# Altium schematic sheet mux6-1(3wires)_sche.SchDoc
size A2 portrait
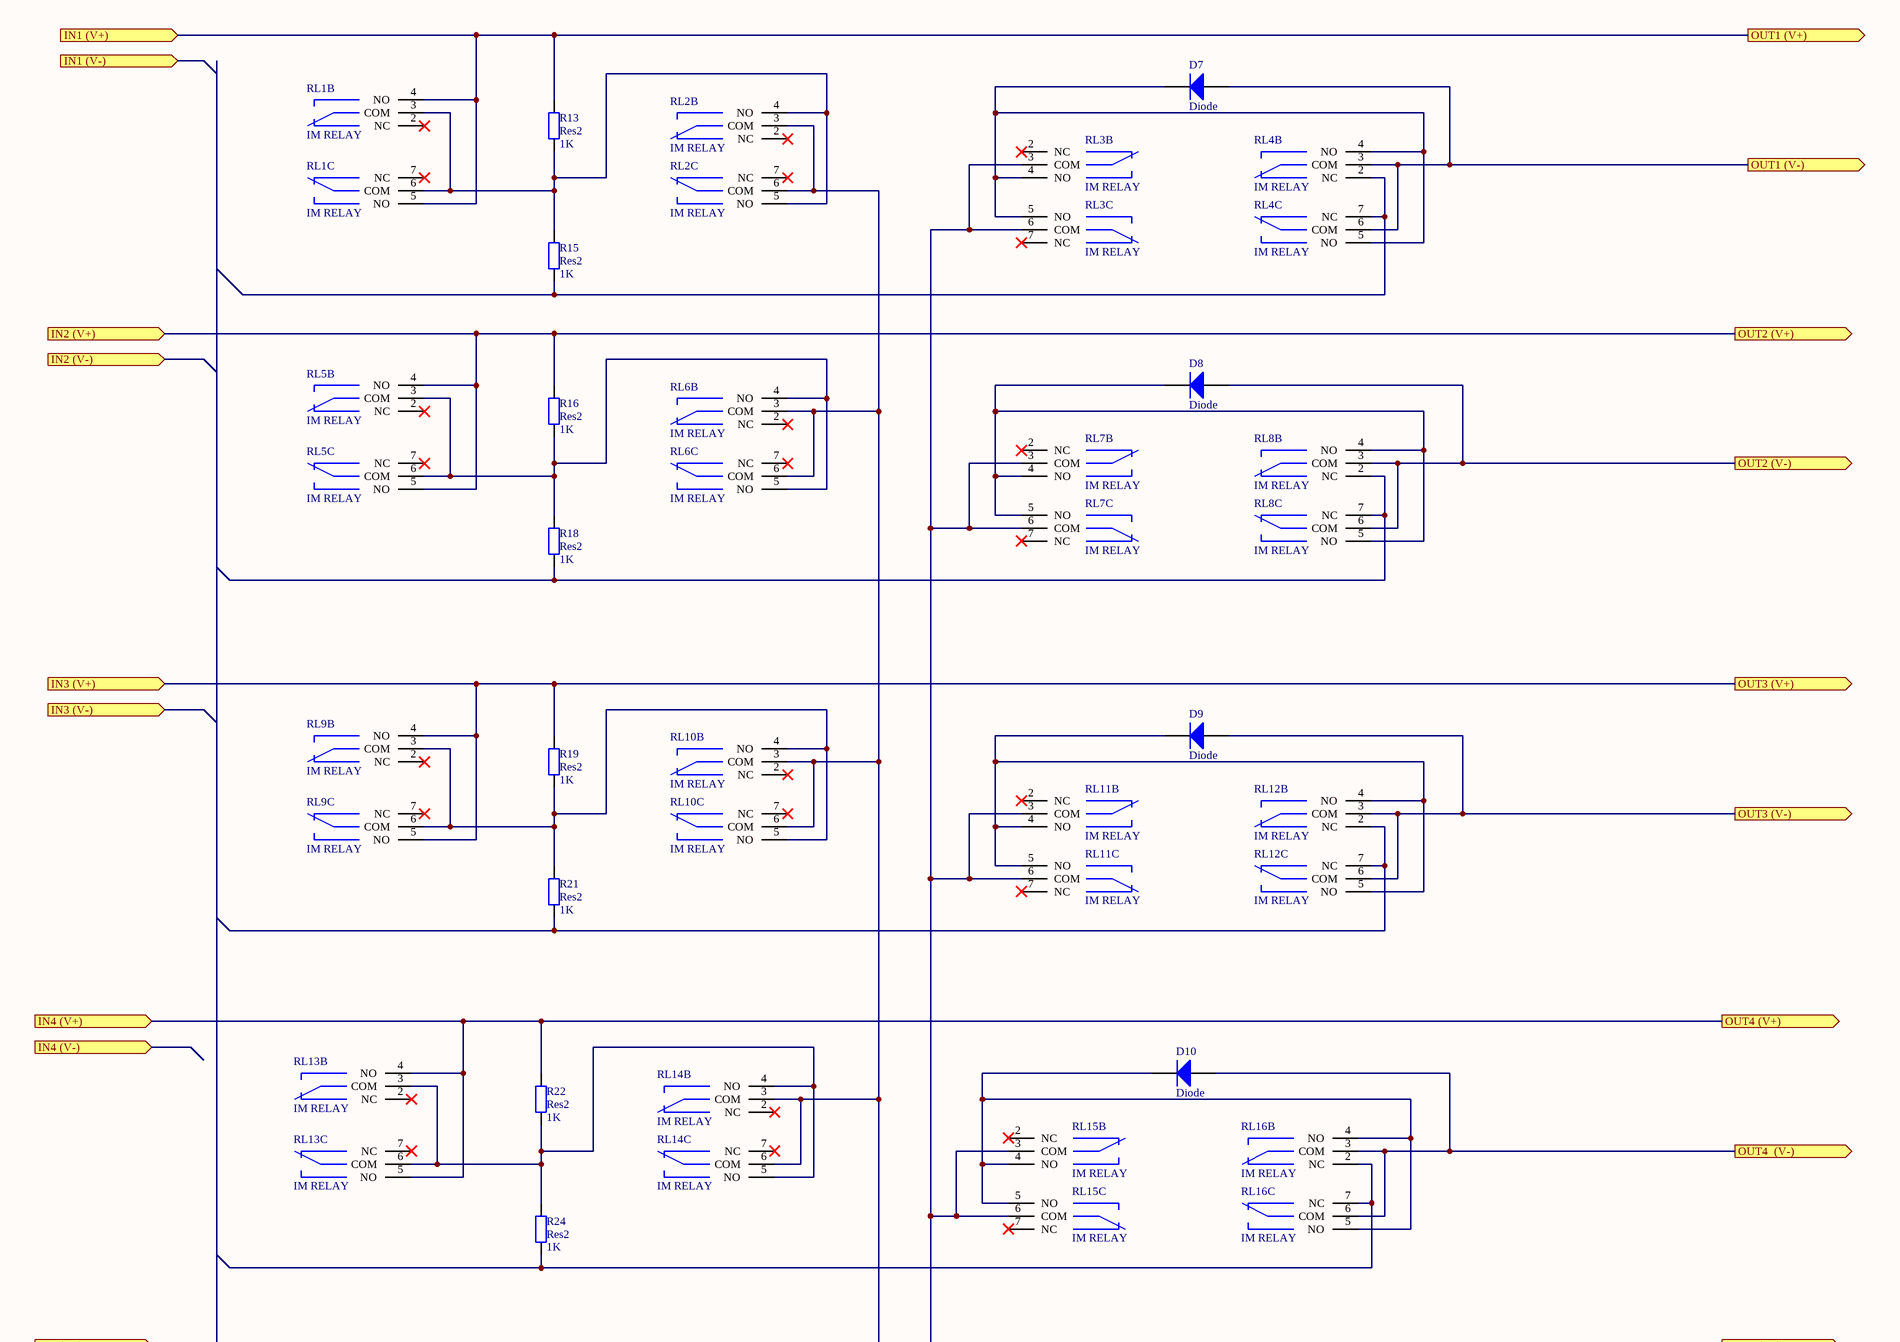
[diagram p0: mux6-1(3wires)_sche.SchDoc, top]
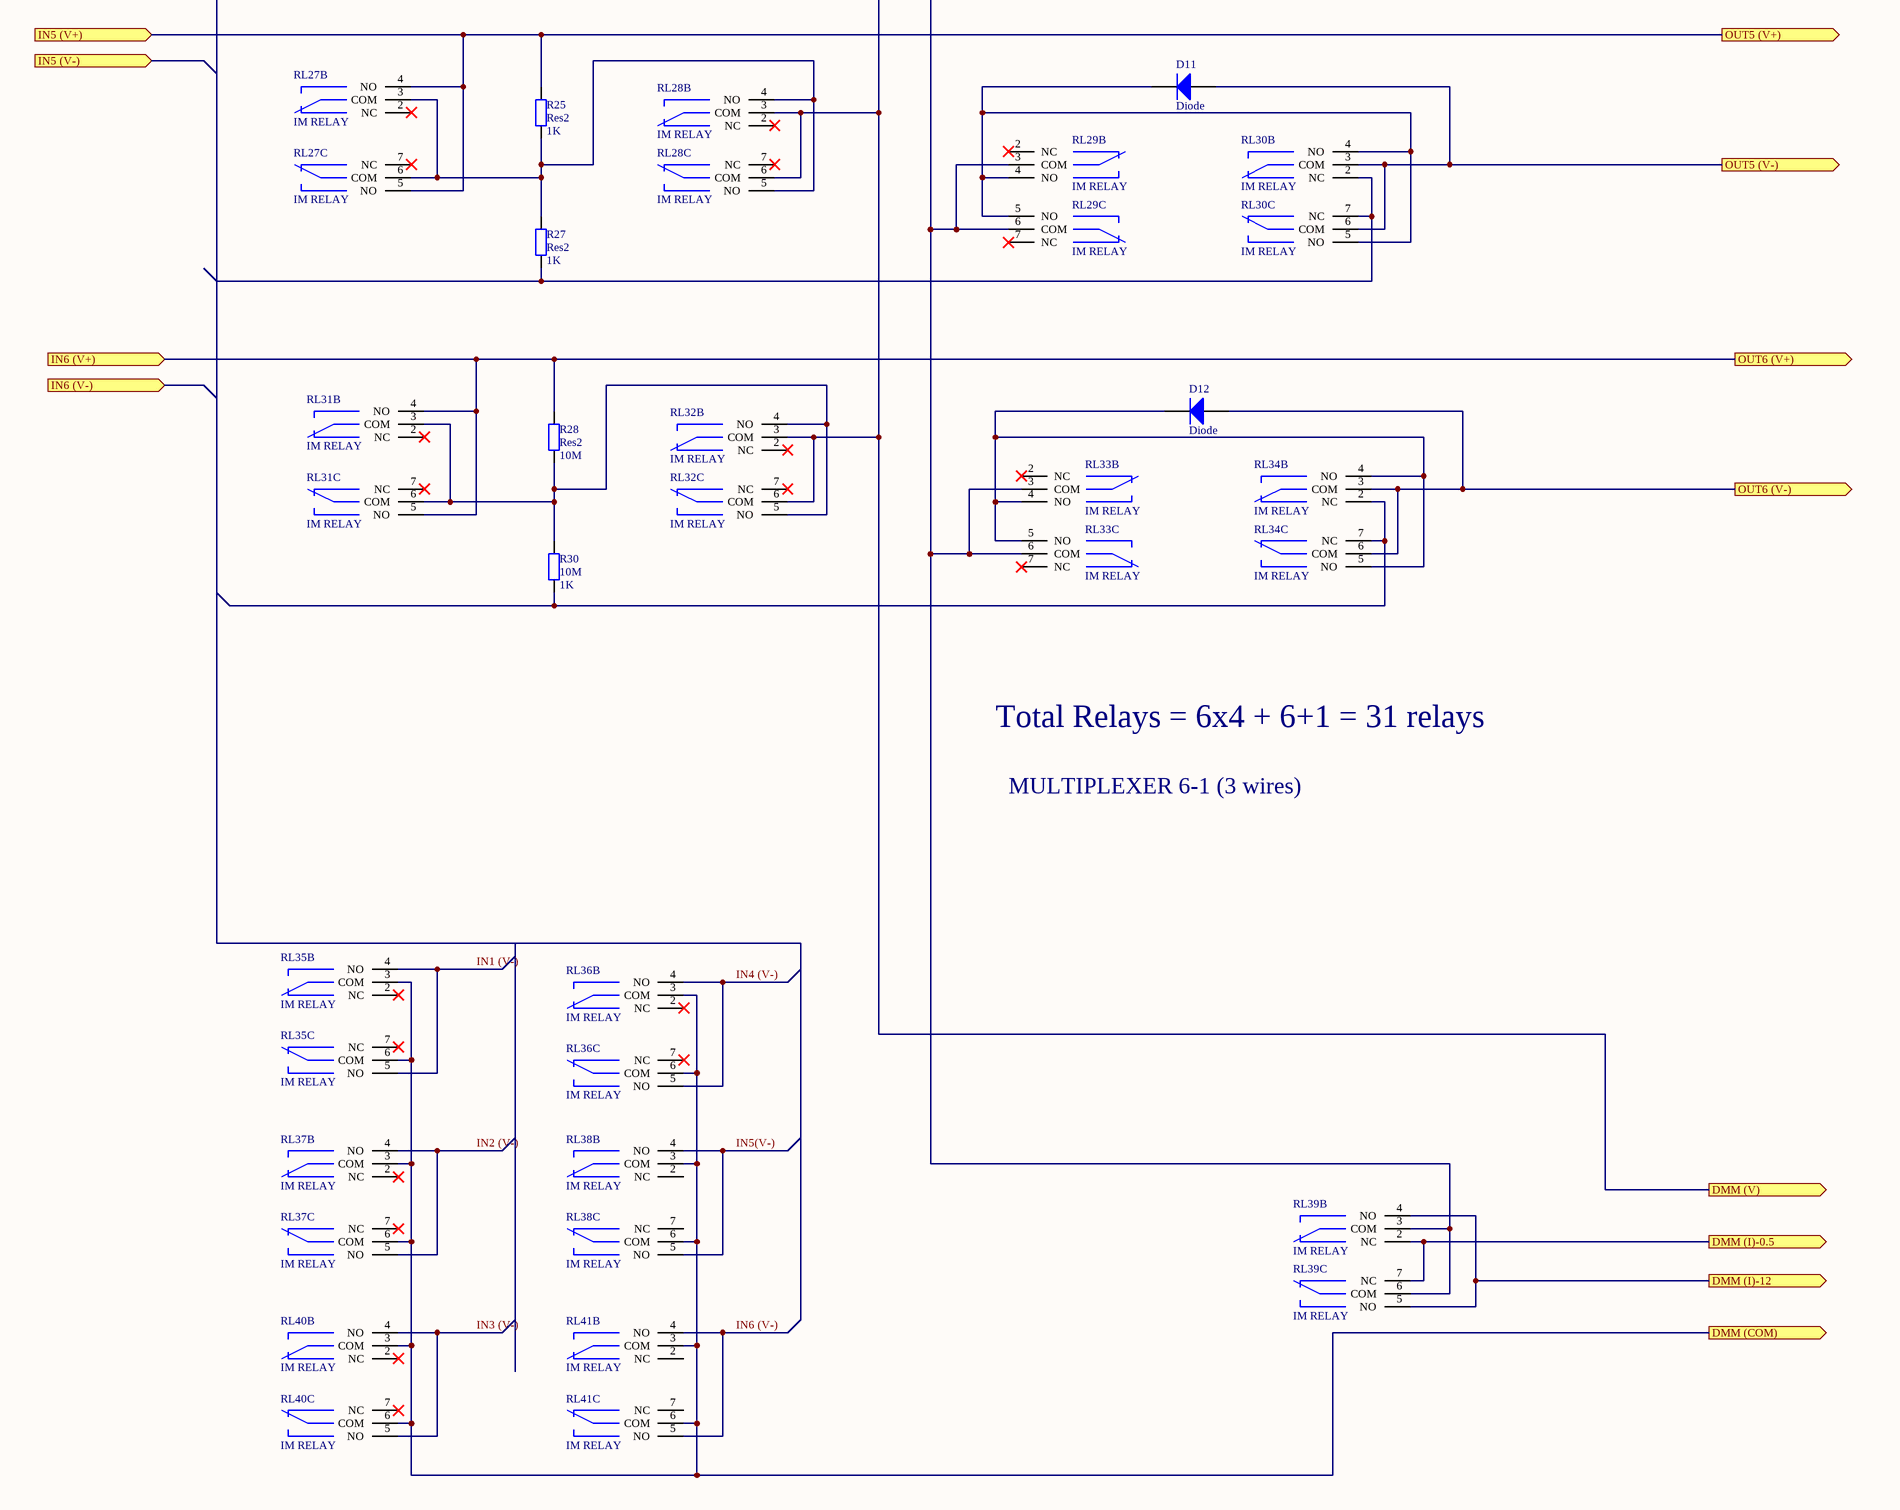
[diagram p1: mux6-1(3wires)_sche.SchDoc, bottom]

## Parts
D7  Diode  [DSO-C2/X3.3]
D8  Diode  [DSO-C2/X3.3]
D9  Diode  [DSO-C2/X3.3]
D10  Diode  [DSO-C2/X3.3]
D11  Diode  [DSO-C2/X3.3]
D12  Diode  [DSO-C2/X3.3]
R13  Res2  value 1K  [AXIAL-0.4]
R15  Res2  value 1K  [AXIAL-0.4]
R16  Res2  value 1K  [AXIAL-0.4]
R18  Res2  value 1K  [AXIAL-0.4]
R19  Res2  value 1K  [AXIAL-0.4]
R21  Res2  value 1K  [AXIAL-0.4]
R22  Res2  value 1K  [AXIAL-0.4]
R24  Res2  value 1K  [AXIAL-0.4]
R25  Res2  value 1K  [AXIAL-0.4]
R27  Res2  value 1K  [AXIAL-0.4]
R28  Res2  value 10M  [AXIAL-0.4]
R30  10M  value 1K  [AXIAL-0.4]
RL1  IM RELAY  [RELAY-DC]  (parts B,C of 3)
RL2  IM RELAY  [RELAY-DC]  (parts B,C of 3)
RL3  IM RELAY  [RELAY-DC]  (parts B,C of 3)
RL4  IM RELAY  [RELAY-DC]  (parts B,C of 3)
RL5  IM RELAY  [RELAY-DC]  (parts B,C of 3)
RL6  IM RELAY  [RELAY-DC]  (parts B,C of 3)
RL7  IM RELAY  [RELAY-DC]  (parts B,C of 3)
RL8  IM RELAY  [RELAY-DC]  (parts B,C of 3)
RL9  IM RELAY  [RELAY-DC]  (parts B,C of 3)
RL10  IM RELAY  [RELAY-DC]  (parts B,C of 3)
RL11  IM RELAY  [RELAY-DC]  (parts B,C of 3)
RL12  IM RELAY  [RELAY-DC]  (parts B,C of 3)
RL13  IM RELAY  [RELAY-DC]  (parts B,C of 3)
RL14  IM RELAY  [RELAY-DC]  (parts B,C of 3)
RL15  IM RELAY  [RELAY-DC]  (parts B,C of 3)
RL16  IM RELAY  [RELAY-DC]  (parts B,C of 3)
RL27  IM RELAY  [RELAY-DC]  (parts B,C of 3)
RL28  IM RELAY  [RELAY-DC]  (parts B,C of 3)
RL29  IM RELAY  [RELAY-DC]  (parts B,C of 3)
RL30  IM RELAY  [RELAY-DC]  (parts B,C of 3)
RL31  IM RELAY  [RELAY-DC]  (parts B,C of 3)
RL32  IM RELAY  [RELAY-DC]  (parts B,C of 3)
RL33  IM RELAY  [RELAY-DC]  (parts B,C of 3)
RL34  IM RELAY  [RELAY-DC]  (parts B,C of 3)
RL35  IM RELAY  [RELAY-DC]  (parts B,C of 3)
RL36  IM RELAY  [RELAY-DC]  (parts B,C of 3)
RL37  IM RELAY  [RELAY-DC]  (parts B,C of 3)
RL38  IM RELAY  [RELAY-DC]  (parts B,C of 3)
RL39  IM RELAY  [RELAY-DC]  (parts B,C of 3)
RL40  IM RELAY  [RELAY-DC]  (parts B,C of 3)
RL41  IM RELAY  [RELAY-DC]  (parts B,C of 3)

## Ports
DMM (COM) (out), DMM (I)-0.5 (out), DMM (I)-12 (out), DMM (V) (out), IN1 (V+) (in), IN1 (V-) (in), IN2 (V+) (in), IN2 (V-) (in), IN3 (V+) (in), IN3 (V-) (in), IN4 (V+) (in), IN4 (V-) (in), IN5 (V+) (in), IN5 (V-) (in), IN6 (V+) (in), IN6 (V-) (in), OUT1 (V+) (out), OUT1 (V-) (out), OUT2 (V+) (out), OUT2 (V-) (out), OUT3 (V+) (out), OUT3 (V-) (out), OUT4  (V-) (out), OUT4 (V+) (out), OUT5 (V+) (out), OUT5 (V-) (out), OUT6 (V+) (out), OUT6 (V-) (out)

## Nets
DMM (COM): RL35.3(COM) RL35.6(COM) RL36.3(COM) RL36.6(COM) RL37.3(COM) RL37.6(COM) RL38.3(COM) RL38.6(COM) RL40.3(COM) RL40.6(COM) RL41.3(COM) RL41.6(COM) ; port DMM (COM)
DMM (I)-0.5: RL39.2(NC) RL39.7(NC) ; port DMM (I)-0.5
DMM (I)-12: RL39.4(NO) RL39.5(NO) ; port DMM (I)-12
DMM (V): RL2.3(COM) RL2.6(COM) RL6.3(COM) RL6.6(COM) RL10.3(COM) RL10.6(COM) RL14.3(COM) RL14.6(COM) RL28.3(COM) RL28.6(COM) RL32.3(COM) RL32.6(COM) ; port DMM (V)
IN1 (V+): R13.2 RL1.4(NO) RL1.5(NO) ; port IN1 (V+), port OUT1 (V+)
IN1 (V-): RL35.4(NO) RL35.5(NO)
IN2 (V+): R16.2 RL5.4(NO) RL5.5(NO) ; port IN2 (V+), port OUT2 (V+)
IN2 (V-): RL37.4(NO) RL37.5(NO)
IN3 (V+): R19.2 RL9.4(NO) RL9.5(NO) ; port IN3 (V+), port OUT3 (V+)
IN3 (V-): RL40.4(NO) RL40.5(NO)
IN4 (V+): R22.2 RL13.4(NO) RL13.5(NO) ; port IN4 (V+), port OUT4 (V+)
IN4 (V-): RL36.4(NO) RL36.5(NO)
IN5 (V+): R25.2 RL27.4(NO) RL27.5(NO) ; port IN5 (V+), port OUT5 (V+)
IN5(V-): RL38.4(NO) RL38.5(NO)
IN6 (V+): R28.2 RL31.4(NO) RL31.5(NO) ; port IN6 (V+), port OUT6 (V+)
IN6 (V-): RL41.4(NO) RL41.5(NO)
OUT1 (V-): D7.1(A) RL4.3(COM) RL4.6(COM) ; port OUT1 (V-)
OUT2 (V-): D8.1(A) RL8.3(COM) RL8.6(COM) ; port OUT2 (V-)
OUT3 (V-): D9.1(A) RL12.3(COM) RL12.6(COM) ; port OUT3 (V-)
OUT4  (V-): D10.1(A) RL16.3(COM) RL16.6(COM) ; port OUT4  (V-)
OUT5 (V-): D11.1(A) RL30.3(COM) RL30.6(COM) ; port OUT5 (V-)
OUT6 (V-): D12.1(A) RL34.3(COM) RL34.6(COM) ; port OUT6 (V-)
NetD7_2: D7.2(K) RL3.4(NO) RL3.5(NO) RL4.4(NO) RL4.5(NO)
NetD8_2: D8.2(K) RL7.4(NO) RL7.5(NO) RL8.4(NO) RL8.5(NO)
NetD9_2: D9.2(K) RL11.4(NO) RL11.5(NO) RL12.4(NO) RL12.5(NO)
NetD10_2: D10.2(K) RL15.4(NO) RL15.5(NO) RL16.4(NO) RL16.5(NO)
NetD11_2: D11.2(K) RL29.4(NO) RL29.5(NO) RL30.4(NO) RL30.5(NO)
NetD12_2: D12.2(K) RL33.4(NO) RL33.5(NO) RL34.4(NO) RL34.5(NO)
NetR13_1: R13.1 R15.2 RL1.3(COM) RL1.6(COM) RL2.4(NO) RL2.5(NO)
NetR15_1: R15.1 RL4.2(NC) RL4.7(NC)
NetR16_1: R16.1 R18.2 RL5.3(COM) RL5.6(COM) RL6.4(NO) RL6.5(NO)
NetR18_1: R18.1 RL8.2(NC) RL8.7(NC)
NetR19_1: R19.1 R21.2 RL9.3(COM) RL9.6(COM) RL10.4(NO) RL10.5(NO)
NetR21_1: R21.1 RL12.2(NC) RL12.7(NC)
NetR22_1: R22.1 R24.2 RL13.3(COM) RL13.6(COM) RL14.4(NO) RL14.5(NO)
NetR24_1: R24.1 RL16.2(NC) RL16.7(NC)
NetR25_1: R25.1 R27.2 RL27.3(COM) RL27.6(COM) RL28.4(NO) RL28.5(NO)
NetR27_1: R27.1 RL30.2(NC) RL30.7(NC)
NetR28_1: R28.1 R30.2 RL31.3(COM) RL31.6(COM) RL32.4(NO) RL32.5(NO)
NetR30_1: R30.1 RL34.2(NC) RL34.7(NC)
NetRL3_3: RL3.3(COM) RL3.6(COM) RL7.3(COM) RL7.6(COM) RL11.3(COM) RL11.6(COM) RL15.3(COM) RL15.6(COM) RL29.3(COM) RL29.6(COM) RL33.3(COM) RL33.6(COM) RL39.3(COM) RL39.6(COM)

Not connected (* = marked no-connect by the designer): RL1 2(NC)* 7(NC)*; RL2 2(NC)* 7(NC)*; RL3 2(NC)* 7(NC)*; RL5 2(NC)* 7(NC)*; RL6 2(NC)* 7(NC)*; RL7 2(NC)* 7(NC)*; RL9 2(NC)* 7(NC)*; RL10 2(NC)* 7(NC)*; RL11 2(NC)* 7(NC)*; RL13 2(NC)* 7(NC)*; RL14 2(NC)* 7(NC)*; RL15 2(NC)* 7(NC)*; RL27 2(NC)* 7(NC)*; RL28 2(NC)* 7(NC)*; RL29 2(NC)* 7(NC)*; RL31 2(NC)* 7(NC)*; RL32 2(NC)* 7(NC)*; RL33 2(NC)* 7(NC)*; RL35 2(NC)* 7(NC)*; RL36 2(NC)* 7(NC)*; RL37 2(NC)* 7(NC)*; RL38 2(NC) 7(NC); RL40 2(NC)* 7(NC)*; RL41 2(NC) 7(NC)

## Notes on the sheet
- Total Relays = 6x4 + 6+1 = 31 relays
- MULTIPLEXER 6-1 (3 wires)

## Library data of the parts
D7-D12 = Diode: Default Diode; Published: 8-Jun-2000; LatestRevisionDate: 17-Jul-2002; LatestRevisionNote: Re-released for DXP Platform.; PackageVersion: Sep-1996; PackageReference: SMC; Publisher: Altium Limited; Code_JEDEC: DO-214-AB
R13 R15 R16 R18 R19 R21 R22 R24 R25 R27 R28 R30 = Res2: Resistor; Published: 8-Jun-2000; LatestRevisionDate: 17-Jul-2002; LatestRevisionNote: Re-released for DXP Platform.; PackageReference: AXIAL-0.4; Publisher: Altium Limited
RL1-RL16 RL27-RL41 = TE/AXICOM RELAY: PCB IM05NS=IM RELAY 140MW 9V. / - I coil: 15.5 mA / - U coil: 9V / - R coil: 574Ohm / - P consumption: 140mW / - I contact: 2A / Switching current 2/5A, switching power 60W/62.5VA and / switching voltage 220VDC/250VAC.; ComponentLink1Description: Mouser; ComponentLink1URL: https://www.mouser.com/ProductDetail/TE-Connectivity-Axicom/1-1462038-5?qs=yXQ4iLa0ZxdCmRWjv%252B0vug%3D%3D